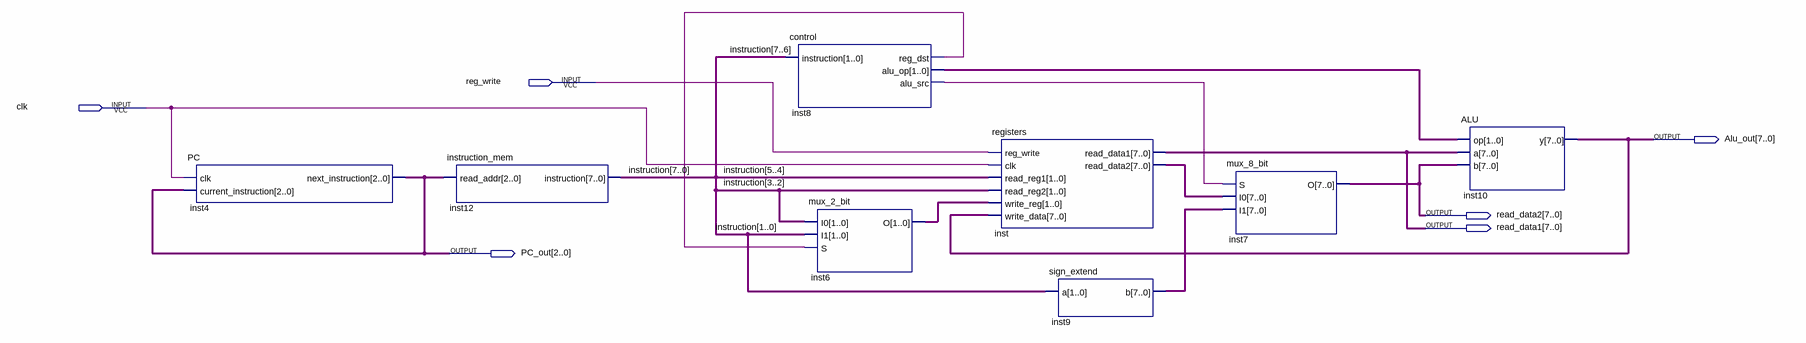
[diagram p0: schematic sheet]
// Quartus schematic Com_or.bdf as structural Verilog: 8 symbols, 6 pins
module Com_or (
  input  reg_write,
  input  clk,
  output [7:0] Alu_out,
  output [7:0] read_data2,
  output [7:0] read_data1,
  output [2:0] PC_out
);

  wire inst8_alu_src, inst8_reg_dst;
  wire [1:0] inst6_o, inst8_alu_op;
  wire [7:0] inst9_b, inst_read_data2, instruction;

  PC inst4 (.clk(clk), .current_instruction(PC_out), .next_instruction(PC_out));
  instruction_mem inst12 (.read_addr(PC_out), .instruction(instruction));
  control inst8 (
    .instruction(instruction[7:6]), .reg_dst(inst8_reg_dst), .alu_src(inst8_alu_src), .alu_op(inst8_alu_op));
  mux_2_bit inst6 (.I0(instruction[3:2]), .I1(instruction[1:0]), .S(inst8_reg_dst), .O(inst6_o));
  registers inst (
    .clk(clk), .reg_write(reg_write), .read_reg1(instruction[5:4]), .read_reg2(instruction[3:2]),
    .write_reg(inst6_o), .write_data(Alu_out), .read_data1(read_data1), .read_data2(inst_read_data2));
  sign_extend inst9 (.a(instruction[1:0]), .b(inst9_b));
  mux_8_bit inst7 (.I0(inst_read_data2), .I1(inst9_b), .S(inst8_alu_src), .O(read_data2));
  ALU inst10 (.a(read_data1), .b(read_data2), .op(inst8_alu_op), .y(Alu_out));
endmodule
